# EAGLE schematic main-controller-v1.0 (EAGLE 9.6.2)
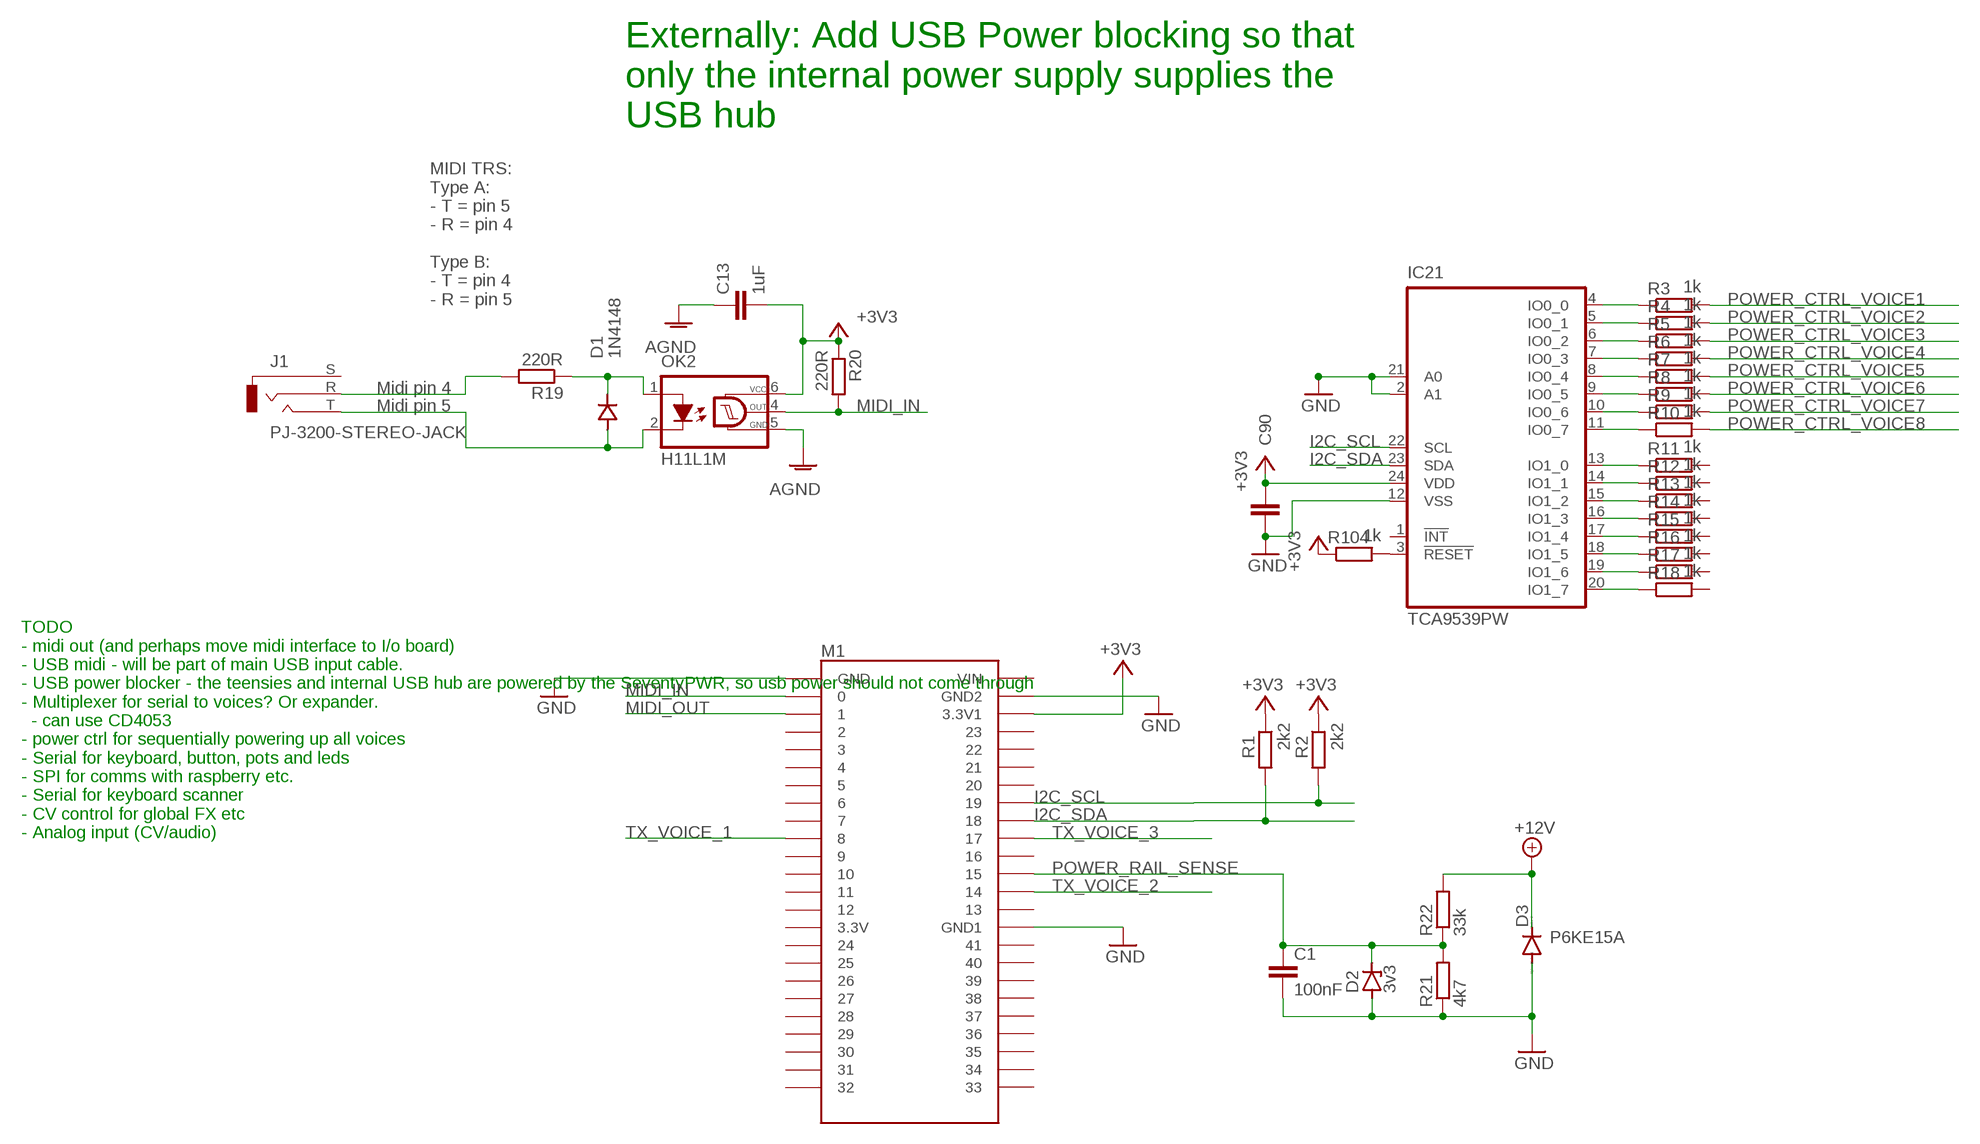
[diagram p0: schematic, sheet 1]

## Parts
C1  100nF  C-EUC0603  [C0603]
C13  1uF  C-EU-J0402  [C0402-J]
C90  1uF  C-EU-J0402  [C0402-J]
D1  1N4148  1N4148SOD323  [SOD323J]
D2  3v3  ZENER-DIODEZD-5  [ZDIO-5]
D3  P6KE15A  DIODE-D-10  [D-10]
IC21  TCA9539PW  PCA9539PW  [TSSOP24J]
J1  PJ-3200-STEREO-JACK  [PJ-3200-JACK]
M1  TEENSY4.1-BARE  [TEENSY4.1-BARE]
OK2  H11L1M  [DIL06J]
R1  2k2  R-EU_R0603  [R0603]
R2  2k2  R-EU_R0603  [R0603]
R3  1k  R-EU_R0402  [R0402]
R4  1k  R-EU_R0402  [R0402]
R5  1k  R-EU_R0402  [R0402]
R6  1k  R-EU_R0402  [R0402]
R7  1k  R-EU_R0402  [R0402]
R8  1k  R-EU_R0402  [R0402]
R9  1k  R-EU_R0402  [R0402]
R10  1k  R-EU_R0402  [R0402]
R11  1k  R-EU_R0402  [R0402]
R12  1k  R-EU_R0402  [R0402]
R13  1k  R-EU_R0402  [R0402]
R14  1k  R-EU_R0402  [R0402]
R15  1k  R-EU_R0402  [R0402]
R16  1k  R-EU_R0402  [R0402]
R17  1k  R-EU_R0402  [R0402]
R18  1k  R-EU_R0402  [R0402]
R19  220R  R-EU_R0603  [R0603]
R20  220R  R-EU_R0603  [R0603]
R21  4k7  R-EU_R0603  [R0603]
R22  33k  R-EU_R0603  [R0603]
R104  1k  R-EU_R0402  [R0402]

## Nets
+3V3: C13.2 C90.2 IC21.24(VDD) M1.3V3_LO(3.3V1) OK2.6(VCC) R1.1 R2.1 R20.1 R104.1
+12V: D3.C R22.2
AGND: C13.1 OK2.5(GND)
GND: C1.2 C90.1 D2.A D3.A IC21.12(VSS) M1.AGND(GND2) M1.GND M1.GND1 R21.1
I2C_SCL: IC21.22(SCL) M1.19/A5/SCL R2.2
I2C_SDA: IC21.23(SDA) M1.18/A4/SDA R1.2
MIDI_IN: M1.0/RX OK2.4(OUT) R20.2
MIDI_OUT: M1.1/TX
N$1: IC21.13(IO1_0) R11.1
N$2: IC21.2(A1) IC21.21(A0) ; supply symbol labelled GND
N$5: IC21.14(IO1_1) R12.1
N$6: IC21.15(IO1_2) R13.1
N$7: IC21.16(IO1_3) R14.1
N$9: IC21.17(IO1_4) R15.1
N$10: IC21.18(IO1_5) R16.1
N$11: IC21.19(IO1_6) R17.1
N$12: IC21.20(IO1_7) R18.1
N$18: IC21.4(IO0_0) R3.1
N$19: IC21.5(IO0_1) R4.1
N$21: IC21.3(!RESET) R104.2
N$45: IC21.6(IO0_2) R5.1
N$49: D1.1(C) OK2.1(A) R19.1
N$51: D1.2(A) J1.T OK2.2(C)
N$52: J1.R R19.2
N$100: IC21.7(IO0_3) R6.1
N$104: IC21.8(IO0_4) R7.1
N$105: IC21.9(IO0_5) R8.1
N$106: IC21.10(IO0_6) R9.1
N$107: IC21.11(IO0_7) R10.1
POWER_CTRL_VOICE1: R3.2
POWER_CTRL_VOICE2: R4.2
POWER_CTRL_VOICE3: R5.2
POWER_CTRL_VOICE4: R6.2
POWER_CTRL_VOICE5: R7.2
POWER_CTRL_VOICE6: R8.2
POWER_CTRL_VOICE7: R9.2
POWER_CTRL_VOICE8: R10.2
POWER_RAIL_SENSE: C1.1 D2.C M1.15/A1 R21.2 R22.1
TX_VOICE_1: M1.8
TX_VOICE_2: M1.14/A0
TX_VOICE_3: M1.17/A3
Unconnected: IC21.1(!INT) J1.S M1.2 M1.3 M1.3V3(3.3V) M1.4 M1.5 M1.6 M1.7 M1.9 M1.10/CS M1.11/MOSI M1.12/MISO M1.13/SCK M1.16/A2 M1.20/A6 M1.21/A7 M1.22/A8 M1.23/A9 M1.24 M1.25 M1.26 M1.27 M1.28 M1.29 M1.30 M1.31/A12 M1.32 M1.33 M1.34 M1.35 M1.36 M1.37 M1.38 M1.39 M1.40 M1.41 M1.VIN R11.2 R12.2 R13.2 R14.2 R15.2 R16.2 R17.2 R18.2

## Notes on the sheet
- Externally: Add USB Power blocking so that
  only the internal power supply supplies the
  USB hub
- MIDI TRS:
  Type A: 
  - T = pin 5
  - R = pin 4
  
  Type B:
  - T = pin 4
  - R = pin 5
- Midi pin 4
- Midi pin 5
- TODO
  - midi out (and perhaps move midi interface to I/o board)
  - USB midi - will be part of main USB input cable.
  - USB power blocker - the teensies and internal USB hub are powered by the SeventyPWR, so usb power should not come through
  - Multiplexer for serial to voices? Or expander.
    - can use CD4053
  - power ctrl for sequentially powering up all voices
  - Serial for keyboard, button, pots and leds
  - SPI for comms with raspberry etc.
  - Serial for keyboard scanner
  - CV control for global FX etc
  - Analog input (CV/audio)

## Library data of the parts
C1 = rcl:C-EU: CAPACITOR, European symbol; SPICEPREFIX: C
C13 C90 = joakim:C-EU-J: CAPACITOR, European symbol
D1 = joakim:1N4148: DIODE high speed (Philips)
D2 = diode:ZENER-DIODE: Z-Diode
D3 = diode:DIODE-: DIODE
IC21 = joakim:PCA9539: 16ch i/o expander. RPW version resets only internal statemachine to get out of stuck i2c-bus, other versions also reset outputs. Interrupt output requires external pull-up resistor for all variants. https://www.nxp.com/docs/en/data-sheet/PCA9539_PCA9539R.pdf
J1 = joakim:PJ-3200-STEREO-JACK: PJ-3200 Unswitched 3.5mm stereo jack.
M1 = joakim:TEENSY4.1-BARE
OK2 = joakim:H11L*M: 6-Pin DIP Optocoupler Source: http://www.fairchildsemi.com/ds/H1/H11L2-M.pdf; MF: FAIRCHILD SEMICONDUCTOR; MPN: H11L1-M; OC_FARNELL: 1021127; OC_NEWARK: 72K8643
R1-R22 R104 = rcl:R-EU_: RESISTOR, European symbol; SPICEPREFIX: R